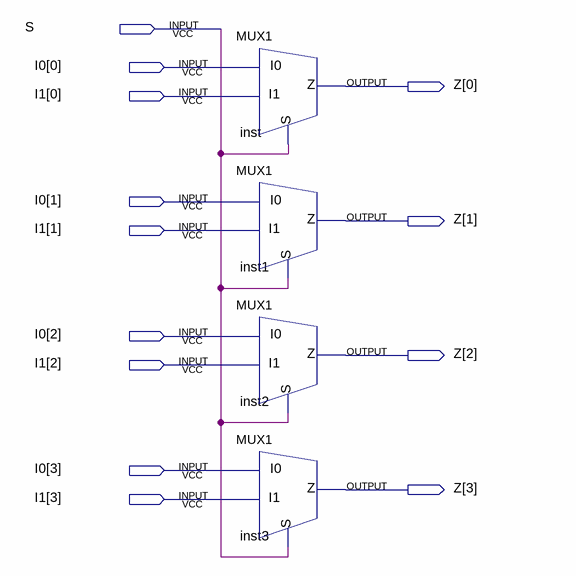
[diagram p0: schematic sheet]
// Quartus schematic MUX4.bdf as structural Verilog: 4 symbols, 13 pins
module MUX4 (
  input  S,
  input  [3:0] I0,
  input  [3:0] I1,
  output [3:0] Z
);

  MUX1 inst (.I0(I0[0]), .I1(I1[0]), .S(S), .Z(Z[0]));
  MUX1 inst1 (.I0(I0[1]), .I1(I1[1]), .S(S), .Z(Z[1]));
  MUX1 inst2 (.I0(I0[2]), .I1(I1[2]), .S(S), .Z(Z[2]));
  MUX1 inst3 (.I0(I0[3]), .I1(I1[3]), .S(S), .Z(Z[3]));
endmodule
